# EAGLE design one_Mhz (EAGLE 7.7.0)
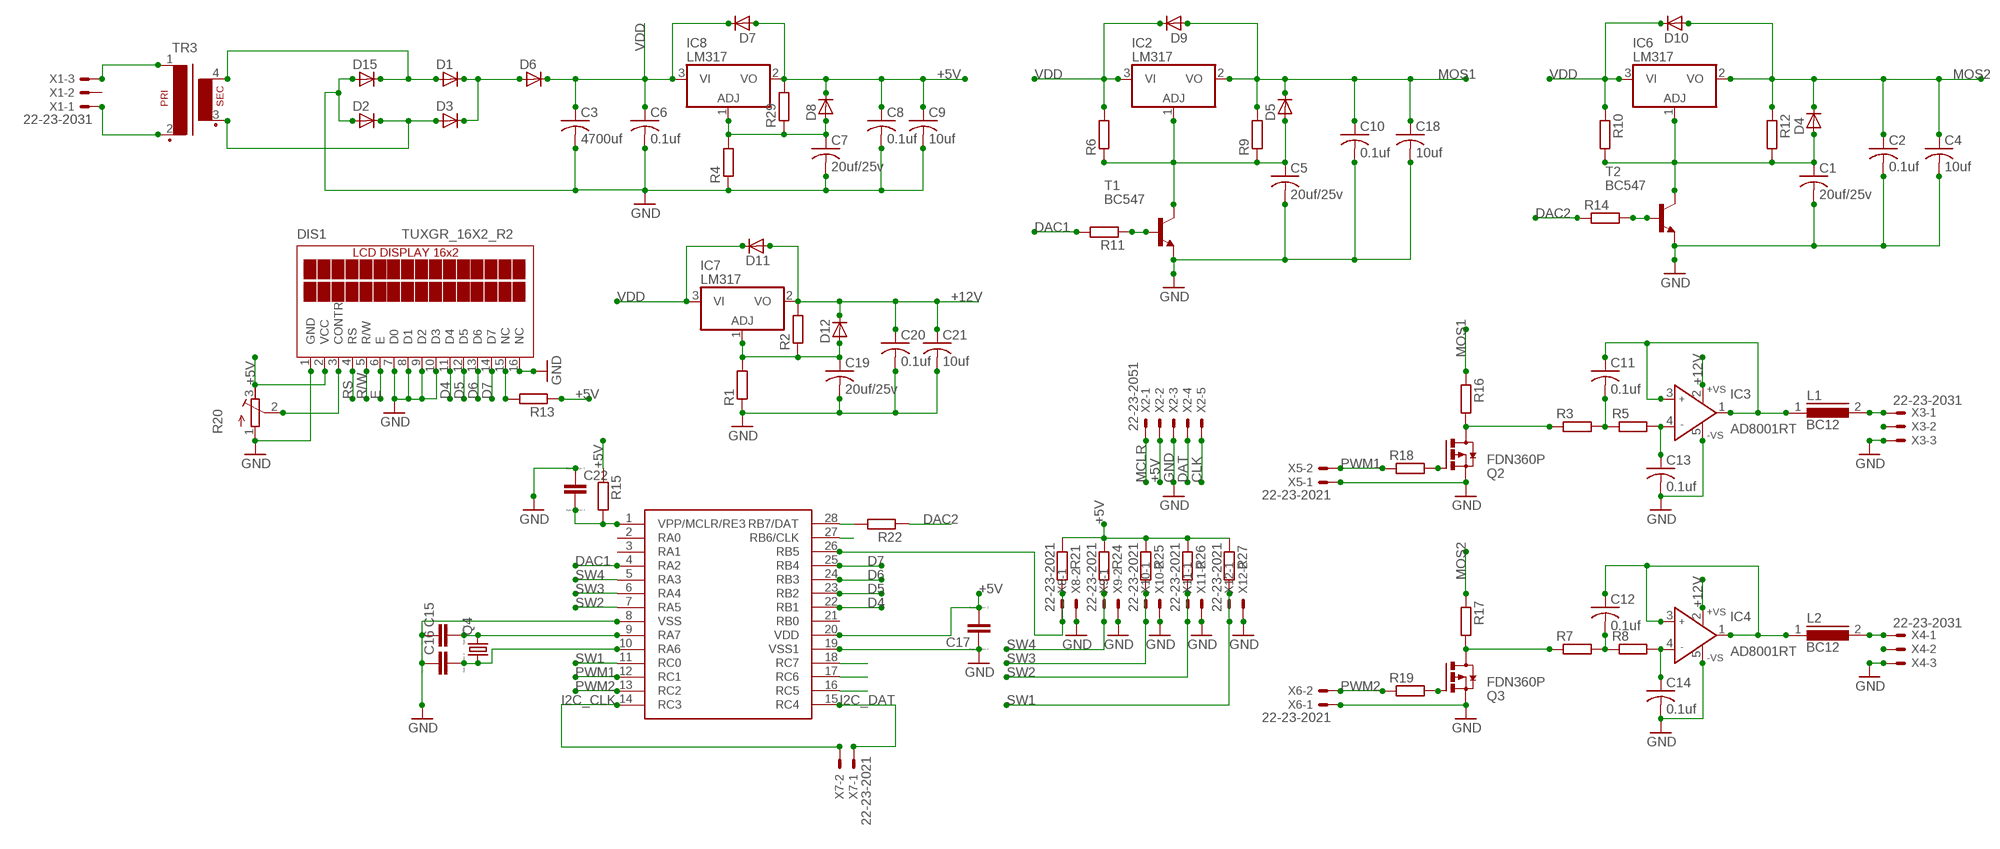
[diagram p0: schematic, sheet 1]

## Parts
C1  20uf/25v  C-US025-025X050  [C025-025X050]
C2  0.1uf  C-US025-025X050  [C025-025X050]
C3  4700uf  C-US025-025X050  [C025-025X050]
C4  10uf  C-US025-025X050  [C025-025X050]
C5  20uf/25v  C-US025-025X050  [C025-025X050]
C6  0.1uf  C-US025-025X050  [C025-025X050]
C7  20uf/25v  C-US025-025X050  [C025-025X050]
C8  0.1uf  C-US025-025X050  [C025-025X050]
C9  10uf  C-US025-025X050  [C025-025X050]
C10  0.1uf  C-US025-025X050  [C025-025X050]
C11  0.1uf  C-US025-025X050  [C025-025X050]
C12  0.1uf  C-US025-025X050  [C025-025X050]
C13  0.1uf  C-US025-025X050  [C025-025X050]
C14  0.1uf  C-US025-025X050  [C025-025X050]
C15  CC0603  [C0603]
C16  CC0603  [C0603]
C17  CC0603  [C0603]
C18  10uf  C-US025-025X050  [C025-025X050]
C19  20uf/25v  C-US025-025X050  [C025-025X050]
C20  0.1uf  C-US025-025X050  [C025-025X050]
C21  10uf  C-US025-025X050  [C025-025X050]
C22  CC0603  [C0603]
D1  D-SOD-87  [SOD87]
D2  D-SOD-87  [SOD87]
D3  D-SOD-87  [SOD87]
D4  D-SOD-87  [SOD87]
D5  D-SOD-87  [SOD87]
D6  D-SOD-87  [SOD87]
D7  D-SOD-87  [SOD87]
D8  D-SOD-87  [SOD87]
D9  D-SOD-87  [SOD87]
D10  D-SOD-87  [SOD87]
D11  D-SOD-87  [SOD87]
D12  D-SOD-87  [SOD87]
D15  D-SOD-87  [SOD87]
DIS1  TUXGR_16X2_R2  [TUXGR_16X2_R2]
IC2  LM317  78L05Z  [TO92]
IC3  AD8001RT  [SOT23-5]
IC4  AD8001RT  [SOT23-5]
IC6  LM317  78L05Z  [TO92]
IC7  LM317  7808T  [TO220H]
IC8  LM317  78L05Z  [TO92]
L1  BC12  [BC12]
L2  BC12  [BC12]
Q2  FDN360P  [SUPER-SOT3]
Q3  FDN360P  [SUPER-SOT3]
Q4  CRYSTALHC49U-V  [HC49U-V]
R1  R-EU_R0603  [R0603]
R2  R-EU_R0603  [R0603]
R3  R-EU_R0603  [R0603]
R4  R-EU_R0603  [R0603]
R5  R-EU_R0603  [R0603]
R6  R-EU_R0603  [R0603]
R7  R-EU_R0603  [R0603]
R8  R-EU_R0603  [R0603]
R9  R-EU_R0603  [R0603]
R10  R-EU_R0603  [R0603]
R11  R-EU_R0603  [R0603]
R12  R-EU_R0603  [R0603]
R13  R-EU_R0603  [R0603]
R14  R-EU_R0603  [R0603]
R15  R-EU_R0603  [R0603]
R16  R-EU_R0603  [R0603]
R17  R-EU_R0603  [R0603]
R18  R-EU_R0603  [R0603]
R19  R-EU_R0603  [R0603]
R20  R-TRIMM64X  [RTRIM64X]
R21  R-EU_R0603  [R0603]
R22  R-EU_R0603  [R0603]
R24  R-EU_R0603  [R0603]
R25  R-EU_R0603  [R0603]
R26  R-EU_R0603  [R0603]
R27  R-EU_R0603  [R0603]
R29  R-EU_R0603  [R0603]
T1  BC547  [TO92]
T2  BC547  [TO92]
TR3  VR13-1  [VR13-1]
U$1  PIC16F15345  [SO28W]
X1  22-23-2031  [22-23-2031]
X2  22-23-2051  [22-23-2051]
X3  22-23-2031  [22-23-2031]
X4  22-23-2031  [22-23-2031]
X5  22-23-2021  [22-23-2021]
X6  22-23-2021  [22-23-2021]
X7  22-23-2021  [22-23-2021]
X8  22-23-2021  [22-23-2021]
X9  22-23-2021  [22-23-2021]
X10  22-23-2021  [22-23-2021]
X11  22-23-2021  [22-23-2021]
X12  22-23-2021  [22-23-2021]

## Nets
+5V: C8.1 C9.1 C17.2 D7.2(A) D8.1(C) DIS1.2(VCC) IC8.2(VO) R13.1 R15.1 R20.3(E) R21.1 R24.1 R25.1 R26.1 R27.1 R29.2 U$1.20(VDD) X2.2
+12V: C20.1 C21.1 D11.2(A) D12.1(C) IC3.2(+VS) IC4.2(+VS) IC7.2(VO) R2.2
CLK: U$1.27(RB6/CLK) X2.5
D4: DIS1.11(D4) U$1.22(RB1)
D5: DIS1.12(D5) U$1.23(RB2)
D6: DIS1.13(D6) U$1.24(RB3)
D7: DIS1.14(D7) U$1.25(RB4)
DAC1: R11.2 U$1.4(RA2)
DAC2: R14.1 R22.1
DAT: R22.2 U$1.28(RB7/DAT) X2.4
E: DIS1.6(E) U$1.18(RC7)
GND: C1.2 C2.2 C3.2 C4.2 C5.2 C6.2 C7.2 C8.2 C9.2 C10.2 C13.2 C14.2 C15.1 C16.1 C17.1 C18.2 C19.2 C20.2 C21.2 C22.1 D2.2(A) D15.2(A) DIS1.1(GND) DIS1.7(D0) DIS1.8(D1) DIS1.9(D2) DIS1.10(D3) DIS1.16(NC) IC3.5(-VS) IC4.5(-VS) Q2.2(S) Q3.2(S) R1.1 R4.1 R20.1(A) T1.1(E) T2.1(E) U$1.8(VSS) U$1.19(VSS1) X2.3 X3.3 X4.3 X5.1 X6.1 X8.2 X9.2 X10.2 X11.2 X12.2
I2C_CLK: U$1.14(RC3) X7.2
I2C_DAT: U$1.15(RC4) X7.1
MCLR: C22.2 R15.2 U$1.1(VPP/MCLR/RE3) X2.1
MOS1: C10.1 C18.1 D5.1(C) D9.2(A) IC2.2(VO) R9.2 R16.1
MOS2: C2.1 C4.1 D4.1(C) D10.2(A) IC6.2(VO) R12.1 R17.1
N$1: L2.2 X4.1
N$3: D1.1(C) D3.1(C) D6.2(A)
N$4: D1.2(A) D15.1(C) TR3.4(S4)
N$5: D2.1(C) D3.2(A) TR3.3(S3)
N$6: Q3.3(D) R7.1 R17.2
N$7: C13.1 IC3.4(IN-) R5.2
N$8: DIS1.15(NC) R13.2
N$9: Q2.3(D) R3.1 R16.2
N$10: C7.1 D8.2(A) IC8.1(ADJ) R4.2 R29.1
N$11: R21.2 U$1.26(RB5) X8.1
N$12: X4.2
N$13: C14.1 IC4.4(IN-) R8.2
N$14: C12.2 R7.2 R8.1
N$15: C11.2 R3.2 R5.1
N$16: C11.1 IC3.1(OUT) IC3.3(IN+) L1.1
N$17: C12.1 IC4.1(OUT) IC4.3(IN+) L2.1
N$18: DIS1.3(CONTR) R20.2(S)
N$19: Q2.1(G) R18.2
N$20: Q3.1(G) R19.2
N$21: C5.1 D5.2(A) IC2.1(ADJ) R6.1 R9.1 T1.3(C)
N$22: C1.1 D4.2(A) IC6.1(ADJ) R10.2 R12.2 T2.3(C)
N$23: R11.1 T1.2(B)
N$24: R14.2 T2.2(B)
N$25: C19.1 D12.2(A) IC7.1(ADJ) R1.2 R2.1
N$27: L1.2 X3.1
N$28: X3.2
N$29: TR3.1 X1.3
N$30: TR3.2 X1.1
N$31: C16.2 Q4.1 U$1.10(RA6)
N$32: C15.2 Q4.2 U$1.9(RA7)
PWM1: R18.1 U$1.12(RC1) X5.2
PWM2: R19.1 U$1.13(RC2) X6.2
R/W: DIS1.5(R/W) U$1.17(RC6)
RS: DIS1.4(RS) U$1.16(RC5)
SW1: R27.2 U$1.11(RC0) X12.1
SW2: R26.2 U$1.7(RA5) X11.1
SW3: R25.2 U$1.6(RA4) X10.1
SW4: R24.2 U$1.5(RA3) X9.1
VDD: C3.1 C6.1 D6.1(C) D7.1(C) D9.1(C) D10.1(C) D11.1(C) IC2.3(VI) IC6.3(VI) IC7.3(VI) IC8.3(VI) R6.2 R10.1
Unconnected: U$1.2(RA0) U$1.3(RA1) U$1.21(RB0) X1.2

## Library data of the parts
C1-C14 C18-C21 = rcl:C-US: CAPACITOR, American symbol
C15-C17 C22 = eagle-ltspice:C: CAPACITOR, European symbol; SPICEMODEL: NONE; SPICEPREFIX: C
D1-D12 D15 = semicon-smd-ipc:D-: DIODE unfilled
DIS1 = display-lcd:TUXGR_16X2_R2: Tuxgraphics LCD display 16x2 characters reflective, without background light Source: tuxgr_12x2_r2.pdf; OC_FARNELL: unknown; OC_NEWARK: unknown
IC2 IC6-IC8 = lm317:78*: Positive VOLTAGE REGULATOR Source: http://cache.national.com/ds/LM/LM78L05.pdf http://www.fairchildsemi.com/ds/LM/LM7805.pdf
IC3 IC4 = analog-devices:AD8001: 800 MHz, 50 mW Current Feedback Amplifier Source: http://www.analog.com/static/imported-files/data_sheets/AD8001.pdf; MF: ALTERA CORPORATION; MPN: AD8001ARTZ-REEL7; OC_FARNELL: 1651271; OC_NEWARK: 59K6136
L1 L2 = inductors:BC12: INDUCTOR
Q2 Q3 = transistor-power:FDN360P: Single P-Channel, PowerTrench (R) MOSFET Source: http://www.fairchildsemi.com/ds/FD/FDN360P.pdf
Q4 = crystal:CRYSTAL: CRYSTAL; OC_FARNELL: 1666969; OC_NEWARK: unknown
R1-R19 R21 R22 R24-R27 R29 = rcl:R-EU_: RESISTOR, European symbol
R20 = rcl:R-TRIMM: Trimm resistor
T1 T2 = transistor-neu-to92:BC547: NPN TRANSISTOR
TR3 = trafo:VR13-1: TRANSFORMER 1 primary winding, 1 secondary winding, mounting holes BLOCK
U$1 = microchip:PIC16F15345
X1 X3 X4 = con-molex:22-23-2031: .100" (2.54mm) Center Header - 3 Pin; MF: MOLEX; MPN: 22-23-2031; OC_FARNELL: 1462950; OC_NEWARK: 30C0862
X2 = con-molex:22-23-2051: .100" (2.54mm) Center Header - 5 Pin; MF: MOLEX; MPN: 22-23-2051; OC_FARNELL: 1462952; OC_NEWARK: 38C9178
X5-X12 = con-molex:22-23-2021: .100" (2.54mm) Center Header - 2 Pin; MF: MOLEX; MPN: 22-23-2021; OC_FARNELL: 1462926; OC_NEWARK: 25C3832

## Board
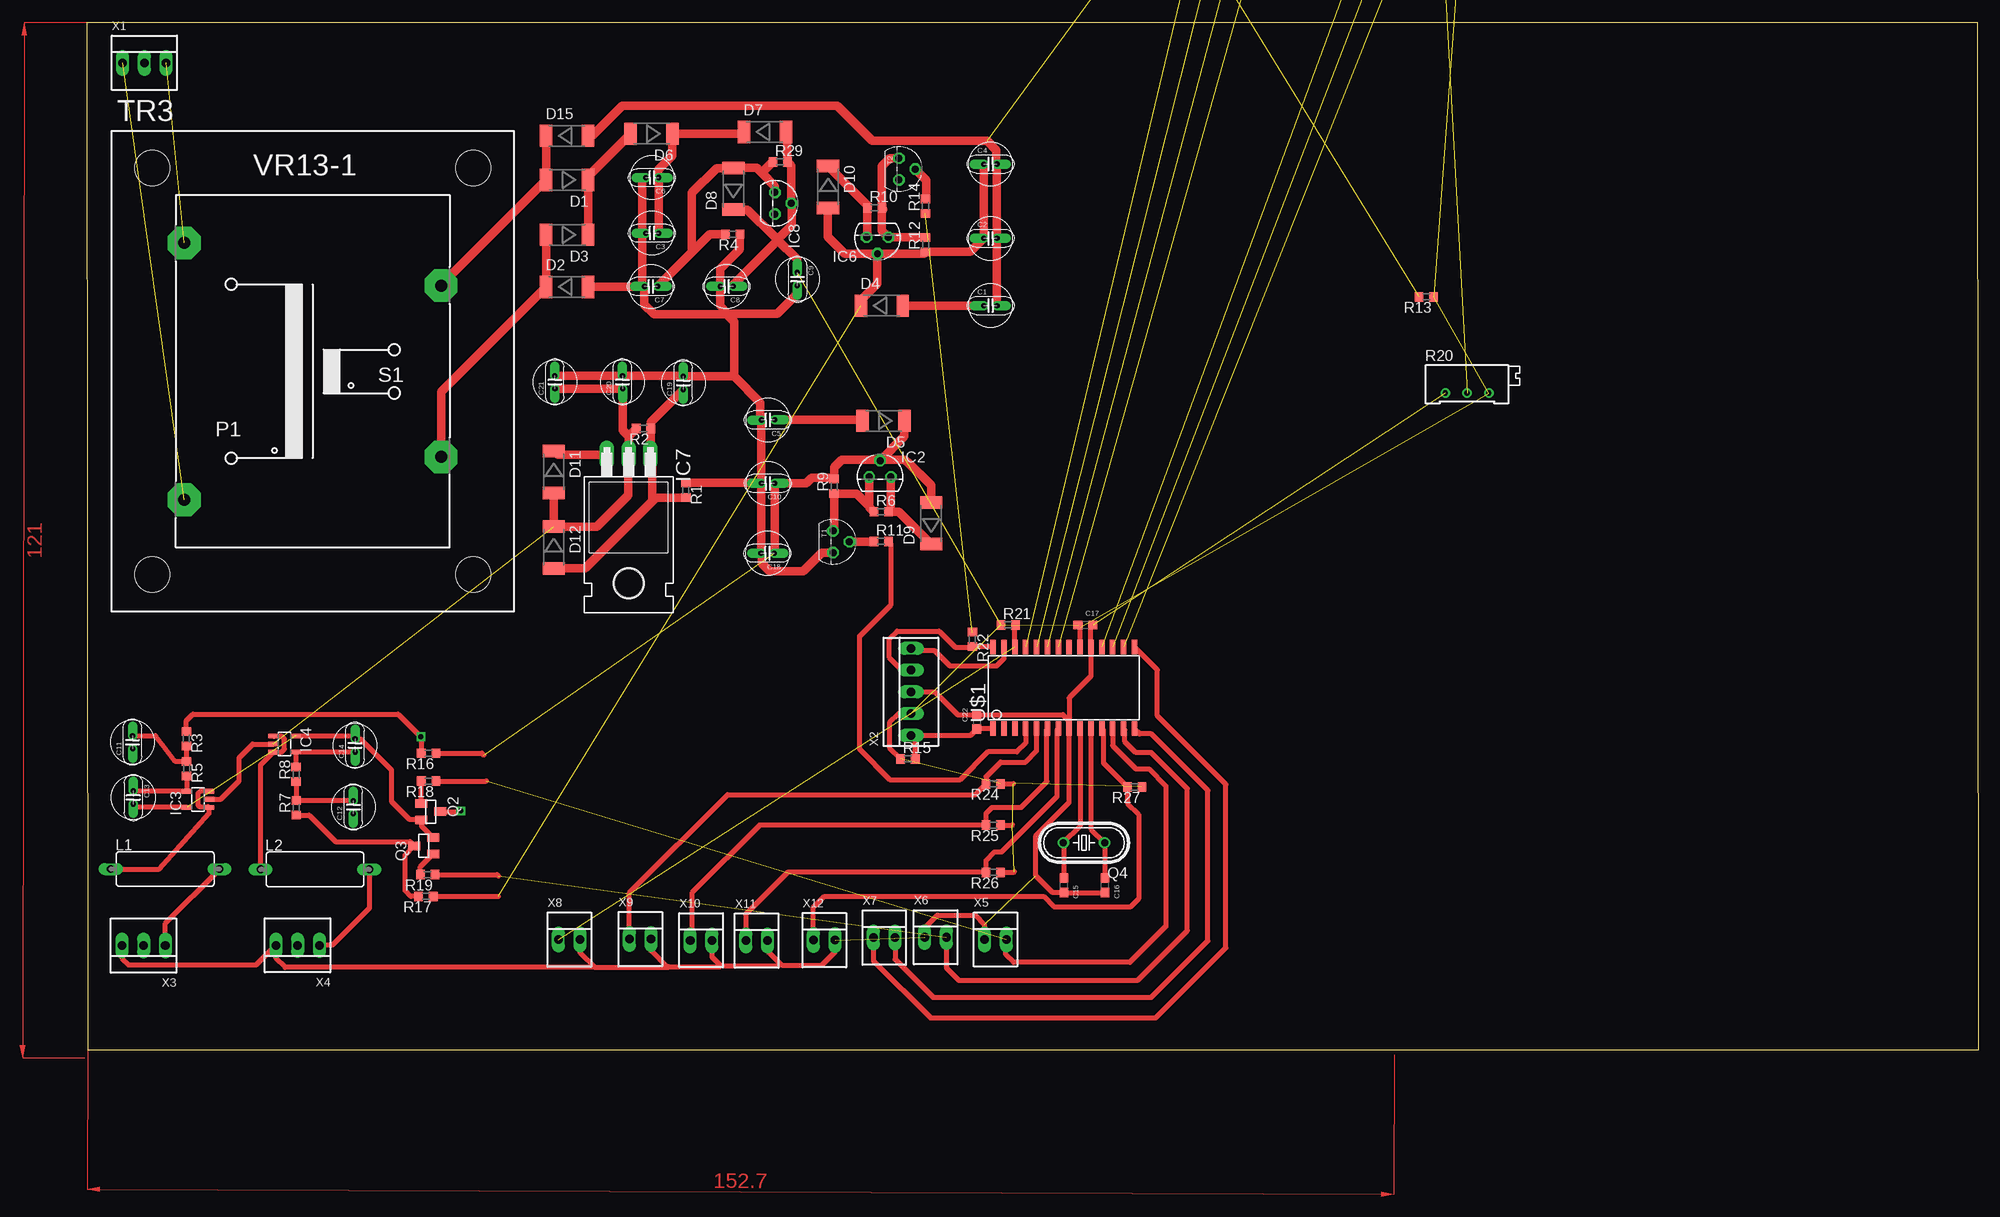
[diagram p1: board, top side]
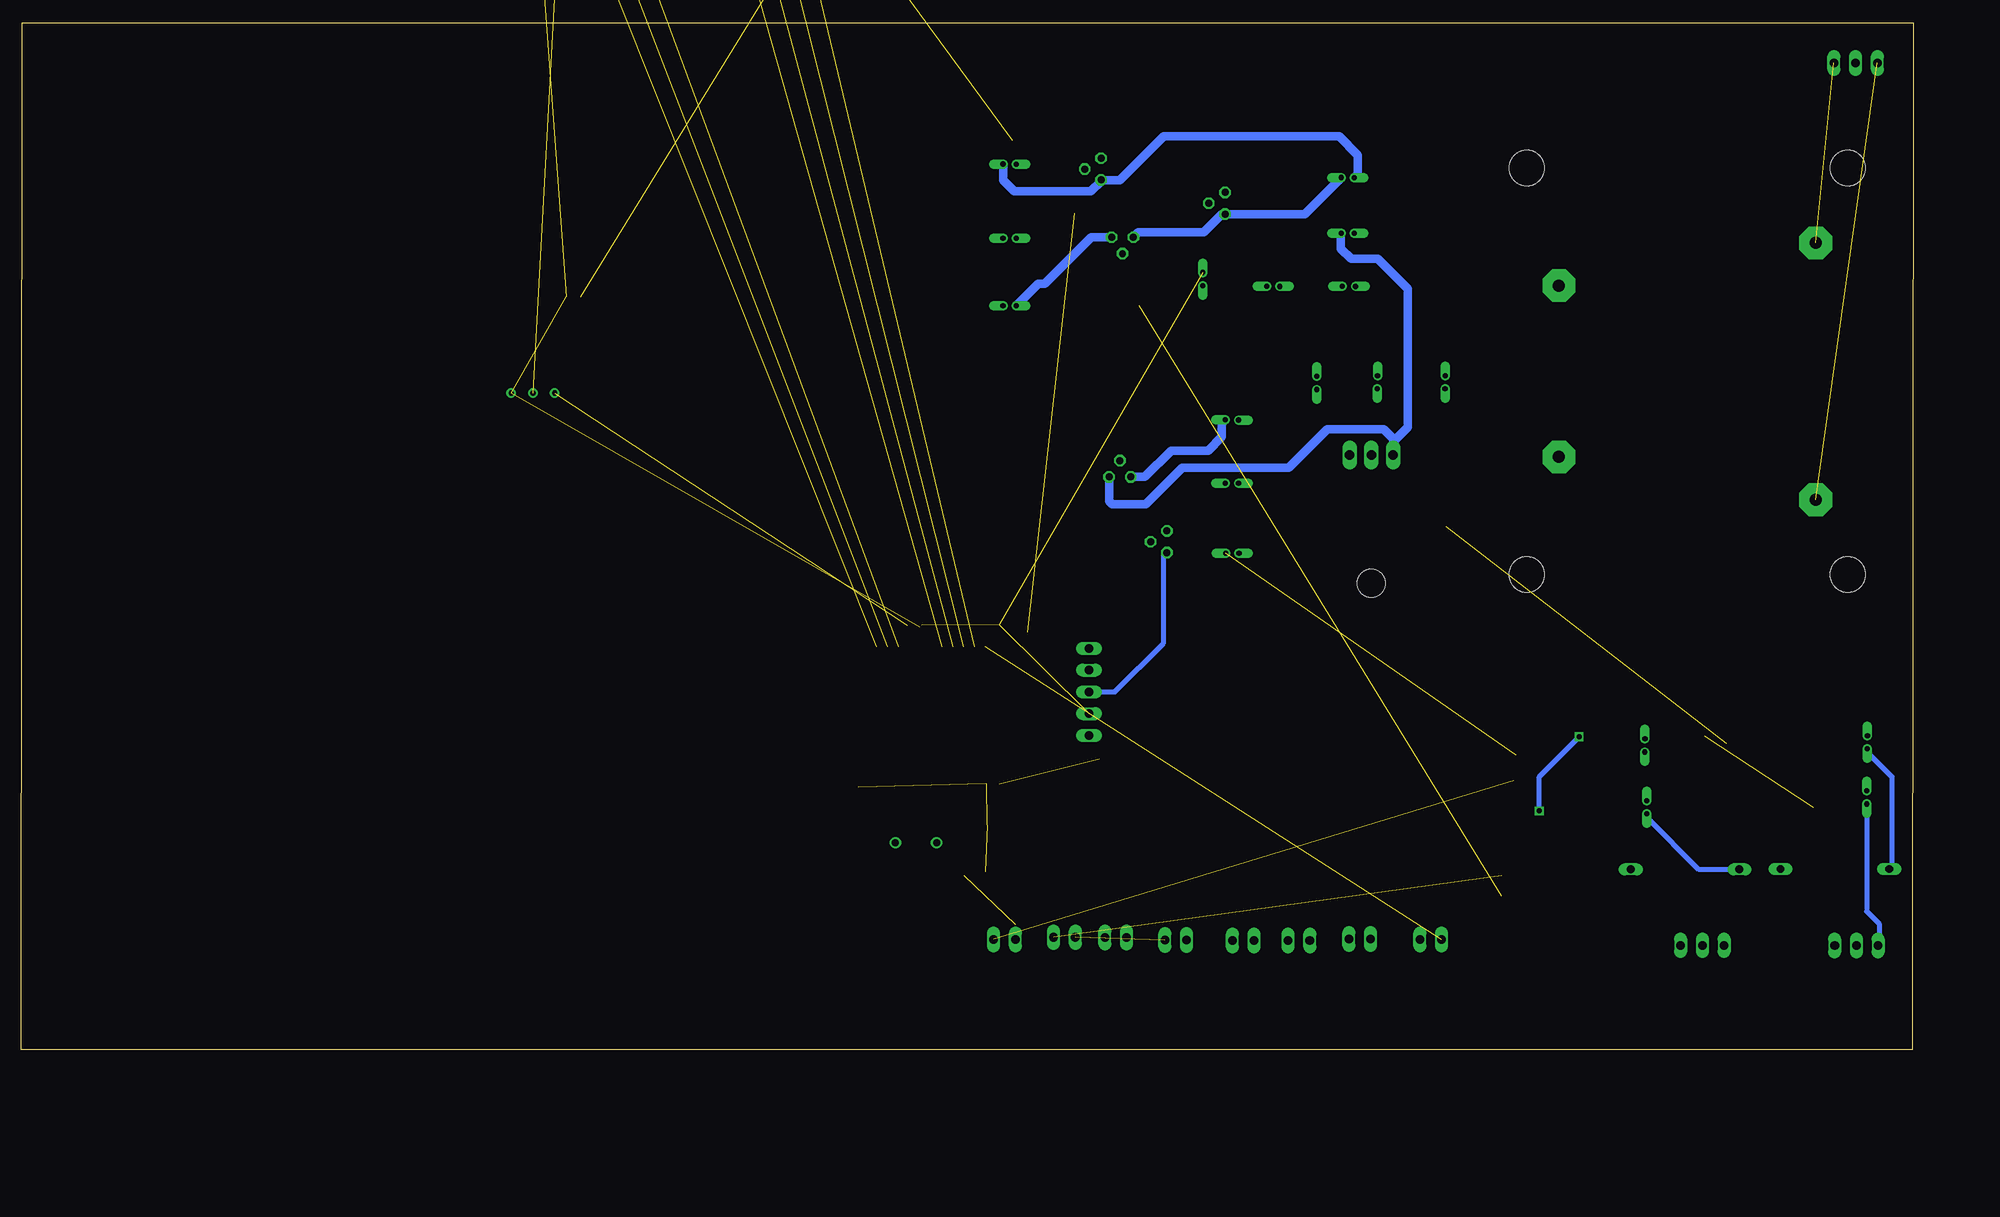
[diagram p2: board, bottom side, seen from below]

Size 221.06 x 120 mm. Coordinates in mm from the lower left corner, seen from the top.
Outline: 0.1,0 221.06,0 220.96,120 0,120 0.1,0
Copper layers (1*16): Top 0.035mm / dielectric 1.5mm / Bottom 0.035mm
Design rules "default": minimum track width 10mil, minimum drill 24mil, track to track 8mil, track to pad 8mil, pad to pad 8mil, via to via 8mil, smd to smd 8mil, copper to edge 40mil, drill to drill 8mil, minimum pad ring 10mil, minimum via ring 8mil, stop-mask expansion 4mil, vias tented up to drill 0mil, thermal gap 10mil

### Footprints (pad centres in the part's own frame; a part is rotated, then mirrored left to right if it is on the bottom)
C025-025X050 = drill 0.6 pad 0.889 offset: 1 -0.776,-0.006; 2 0.759,0.007
C0603 = smd 1.1 x 1: 1 -0.85,0; 2 0.85,0
SOD87 = smd 1.45 x 2.6: 1 -2.445,0; 2 2.445,0
TUXGR_16X2_R2 = drill 1 pad 1.676: 1 -32,15.5; 2 -29.46,15.5; 3 -26.92,15.5; 4 -24.38,15.5; 5 -21.84,15.5; 6 -19.3,15.5; 7 -16.76,15.5; 8 -14.22,15.5; 9 -11.68,15.5; 10 -9.14,15.5; 11 -6.6,15.5; 12 -4.06,15.5; 13 -1.52,15.5; 14 1.02,15.5; 15 3.56,15.5; 16 6.1,15.5 | hole 2.5: -37.5,-15.5; 37.5,-15.5; -37.5,15.5; 37.5,15.5
TO92 = drill 0.813 octagon: 1 -1.27,0; 2 0,1.905; 3 1.27,0
SOT23-5 = smd 0.55 x 1.2: 1 -0.95,-1.3; 2 0,-1.3; 3 0.95,-1.3; 4 0.95,1.3; 5 -0.95,1.3
TO220H = drill 1.118 long: 1 -2.54,-10.16; 2 0,-10.16; 3 2.54,-10.16 | hole 3.302: 0,4.826
BC12 = drill 0.914 long: 1 -6.35,0; 2 6.35,0
SUPER-SOT3 = smd 1 x 1.4: 1 -0.95,-1.1; 2 0.95,-1.1; 3 0,1.1
HC49U-V = drill 0.813: 1 -2.413,0; 2 2.413,0
R0603 = smd 1 x 1.1: 1 -0.85,0; 2 0.85,0
RTRIM64X = drill 0.61: 1 1.27,-2.54; 2 1.27,0; 3 1.27,2.54
TO92' = drill 0.813 octagon: 1 1.27,0; 2 0,1.905; 3 -1.27,0
VR13-1 = drill 1.397 pad 3.81 octagon: 1 -15.011,15.011; 2 -15.011,-15.011; 3 15.011,-10.008; 4 15.011,10.008 | hole 4.115: -18.745,-23.749; 18.745,-23.749; 18.745,23.749; -18.745,23.749
SO28W = smd 0.65 x 1.7: 1 -7.62,-4.78; 2 -6.35,-4.78; 3 -5.08,-4.78; 4 -3.81,-4.78; 5 -2.54,-4.78; 6 -1.27,-4.78; 7 0,-4.78; 8 1.27,-4.78; 9 2.54,-4.78; 10 3.81,-4.78; 11 5.08,-4.78; 12 6.35,-4.78; 13 7.62,-4.78; 14 8.89,-4.78; 15 8.89,4.78; 16 7.62,4.78; 17 6.35,4.78; 18 5.08,4.78; 19 3.81,4.78; 20 2.54,4.78; 21 1.27,4.78; 22 0,4.78; 23 -1.27,4.78; 24 -2.54,4.78; 25 -3.81,4.78; 26 -5.08,4.78; 27 -6.35,4.78; 28 -7.62,4.78
22-23-2031 = drill 1 long: 1 -2.54,0; 2 0,0; 3 2.54,0
22-23-2051 = drill 1 long: 1 -5.08,0; 2 -2.54,0; 3 0,0; 4 2.54,0; 5 5.08,0
22-23-2021 = drill 1 long: 1 -1.27,0; 2 1.27,0

### Placement (x,y rotation side)
C1  105.6,86.93 0 top
C2  105.6,94.8 0 top
C3  66.06,95.4 180 top
C4  105.6,103.47 0 top
C5  79.6,73.57 180 top
C6  66.06,101.89 180 top
C7  65.93,89.18 180 top
C8  74.78,89.18 180 top
C9  83.03,90.02 270 top
C10  79.6,66.17 180 top
C11  5.36,35.92 90 top
C12  31.16,28.33 90 top
C13  5.44,29.46 270 top
C14  31.36,35.55 90 top
C15  114.2,19.2 90 top
C16  119,19.2 90 top
C17  116.7,49.6 180 top
C18  79.55,58 180 top
C19  69.71,77.9 90 top
C20  62.61,78 90 top
C21  54.71,78 90 top
C22  104,38.3 270 top
D1  56.13,101.62 180 top
D2  56.13,89.12 0 top
D3  56.13,95.2 180 top
D4  92.91,86.93 0 top
D5  93.09,73.47 180 top
D6  65.99,107.02 180 top
D7  79.25,107.22 0 top
D8  75.57,100.59 90 top
D9  98.67,61.5 90 top
D10  86.63,100.78 270 top
D11  54.57,67.48 270 top
D12  54.57,58.67 270 top
D15  56.13,106.77 0 top
DIS1  131.28,149.04 180 top  (outside the outline)
IC2  92.7,66.92 0 top
IC3  12.99,29.25 90 top
IC4  23.11,35.71 270 top
IC6  92.4,94.92 180 top
IC7  63.32,59.32 180 top
IC8  80.42,98.89 270 top
L1  9.17,21.1 0 top
L2  26.67,21.06 0 top
Q2  40.21,27.8 270 top
Q3  39.39,23.81 90 top
Q4  116.53,24.17 180 top
R1  70.01,65.36 270 top
R2  65.06,72.57 180 top
R3  11.65,36.34 270 top
R4  75.49,95.27 180 top
R5  11.67,32.84 270 top
R6  92.82,62.85 0 top
R7  24.49,28.26 90 top
R8  24.47,32.16 90 top
R9  87.33,65.82 90 top
R10  92.06,98.35 0 top
R11  92.82,59.39 0 top
R12  98.03,94.06 90 top
R13  156.54,87.95 180 top
R14  98.01,98.56 90 top
R15  95.96,33.97 0 top
R16  39.94,34.63 180 top
R17  39.64,17.91 180 top
R18  39.94,31.37 180 top
R19  39.84,20.45 180 top
R20  161.29,77.99 270 top
R21  107.66,49.63 0 top
R22  103.49,47.94 270 top
R24  105.94,31.05 180 top
R25  105.94,26.23 180 top
R26  105.94,20.71 180 top
R27  122.44,30.69 180 top
R29  81.02,103.73 0 top
T1  BC547  [TO92']  87.21,59.34 270 top
T2  BC547  [TO92']  94.91,102.89 270 top
TR3  26.41,79.26 0 top
U$1  113.53,42.28 0 top
X1  6.74,115.3 0 top
X2  96.3,41.8 90 top
X3  6.64,12.15 180 top
X4  24.64,12.19 180 top
X5  106.19,12.87 0 top
X6  99.19,13.13 0 top
X7  93.19,13.09 0 top
X8  56.39,12.85 0 top
X9  64.69,12.91 0 top
X10  71.79,12.77 0 top
X11  78.29,12.73 0 top
X12  86.19,12.79 0 top

### Tracks (layer width: path | path; a pad name or v marks a point on that pad's centre or on a via)
+5V  (10 unrouted)
  Top 0.61: U$1.20 116.07,49.38 C17.2 | X2.2 94.86,39.26 93.8,38.2 93.8,35.28 R15.1 | R24.1 108.25,31.05 108.3,31.1 | R25.1 108.13,26.23 108.2,26.3 | R26.1 108.31,20.71 108.4,20.8
  Top 1.016: D7.2 81.87,107.05 R29.2 82.33,103.27 IC8.2 82.4,98.81 82.4,96.3 80.94,94.84 80.5,94.84 | 75.47,89.27 C8.1 75.56,89.36 80.77,94.57 | C9.1 83.02,92.32 80.77,94.57 | 80.77,94.57 80.5,94.84 | D8.1 77.2,98.14 80.5,94.84
+12V  (1 unrouted)
  Top 0.61: 21.75,35.65 IC4.2 19.4,35.7 17.8,34.1 17.8,31.4 15.65,29.25 IC3.2
  Top 1.016: C21.1 C20.1 62.62,72.38 63.32,71.68 | 63.02,69.78 IC7.2 | D11.2 D12.1 59.62,61.11 63.3,64.8 63.3,69.46 IC7.2 | IC7.2 63.32,71.68 | 63.32,71.68 R2.2
CLK
  Top 0.61: U$1.27 107.18,45.68 106.3,44.8 100.9,44.8 99.1,46.6 96.58,46.6 X2.5
D4  (1 unrouted)
D5  (1 unrouted)
D6  (1 unrouted)
D7  (1 unrouted)
DAC1
  Top 0.61: U$1.4 109.72,35.82 108.7,34.8 105.3,34.8 102,31.5 93.9,31.5 90.3,35.1 90.3,48.3 94,52 94,59.06 R11.2
DAC2  (1 unrouted)
DAT
  Top 0.61: U$1.28 104.04,47.06 R22.2 103.4,47 101.5,47 99.6,48.9 94.7,48.9 93.8,48 93.8,45.8 95.26,44.34 X2.4
E  (1 unrouted)
GND  (11 unrouted)
  Top 0.61: X2.3 99.1,41.8 101.8,39.1 103.95,39.1 C22.1 114.05,39.15 114.75,38.45 | 114.75,38.45 114.8,38.4 U$1.8 114.8,28.9 110.9,25 110.9,20.3 112.85,18.35 C15.1 C16.1 | C17.1 117.34,49.39 U$1.19 117.34,43.64 114.8,41.1 114.8,38.5 114.75,38.45 | IC3.5 5.85,28.3 C13.2 | X3.3 4.1,10.7 4.9,9.9 19.81,9.9 X4.3 22.1,10.7 23.2,9.6 59.4,9.6 | IC4.5 31,36.66 C14.2 31.99,36.31 35.6,32.7 35.6,29 37.7,26.9 39.06,26.9 Q2.2 39.11,26.14 Q3.2 | X6.1 97.92,14.22 99.4,15.7 103.8,15.7 104.9,14.6 104.9,12.89 X5.1 | X12.2 87.46,11.46 85.8,9.8 81.3,9.8 81.05,10.05 | 81.05,10.05 79.6,11.5 79.6,12.69 X11.2 | X10.2 73.06,10.84 74.1,9.8 | 74.1,9.8 80.8,9.8 81.05,10.05 | X9.2 65.96,11.54 67.8,9.7 | 67.8,9.7 68,9.7 | 68,9.7 74,9.7 74.1,9.8 | X8.2 57.66,11.34 59.4,9.6 | 67.7,9.6 67.8,9.7 | 59.4,9.6 67.9,9.6 68,9.7
  Top 1.016: 64.93,95.02 C3.2 | 64.93,95.02 64.93,101.53 65.3,101.9 | 64.93,95.02 64.93,89.42 C7.2 | C9.2 83.04,88.34 80.7,86 74.9,86 | 74.9,86 74,86.9 74,89.15 C8.2 74.02,91.22 76.3,93.5 76.3,95.23 R4.1 | C7.2 65.17,87.03 66.3,85.9 74.8,85.9 | 74.8,85.9 74.9,86 | C21.2 C20.2 69.6,78.76 C19.2 75.64,78.66 | 75.64,78.66 78.7,75.6 78.7,73.7 C5.2 C10.2 | C10.2 78.84,58.04 C18.2 78.9,57.88 78.9,56.8 79.8,55.9 83.7,55.9 85.87,58.07 T1.1 | R1.1 78.8,66.21 C10.2 | 75.64,78.66 75.64,85.06 74.8,85.9 | C1.2 C2.2 C4.2 106.3,103.53 106.3,105.1 105.2,106.2 91.8,106.2 87.7,110.3 62.6,110.3 59.07,106.77 D15.2 | D2.2 65.12,89.12 C7.2
  Bottom 0.61: X2.3 93.3,41.8 87.6,47.5 87.6,57.68 T1.1 | C13.2 5.45,16.15 4,14.7 4,12.25 X3.3
  Bottom 1.016: C6.2 64.9,102.28 64.9,104.5 67.1,106.7 87.6,106.7 92.7,101.6 94.89,101.6 T2.1 94.91,101.49 96.1,100.3 105.06,100.3 106.36,101.6 C4.2
I2C_CLK
  Top 0.61: X7.2 94.46,10.54 98.9,6.1 124.4,6.1 131,12.7 131,30.3 124.4,36.9 123.02,36.9 U$1.14
I2C_DAT
  Top 0.61: X7.1 91.92,10.38 98.6,3.7 124.9,3.7 133.1,11.9 133.1,31 125.1,39 125.1,44.38 U$1.15
MCLR
  Top 0.61: U$1.1 104.05,37.5 C22.2 103.27,36.72 X2.1 96.81,36.21 R15.2
MOS1  (1 unrouted)
  Top 0.61: R16.1 46.17,34.63 46.4,34.4
  Top 1.016: C18.1 80.38,58.06 C10.1 84.08,66.18 84.7,66.8 87.2,66.8 R9.2 87.33,68.03 88.2,68.9 92.62,68.9 IC2.2 | D5.1 95.53,71.66 IC2.2 | D9.2 98.67,65.93 95.9,68.7 95.8,68.7 95.6,68.9 92.78,68.9 IC2.2
MOS2  (1 unrouted)
  Top 0.61: R17.1 48.09,17.91 48.1,17.9
  Top 1.016: C4.1 C2.1 103.24,93.21 R12.1 97.83,93.02 IC6.2 | IC6.2 92.4,89.5 90.7,87.8 90.7,87.16 D4.1 | IC6.2 88.58,93.02 86.6,95 86.6,98.3 D10.2
N$1
  Top 0.61: L2.2 33.02,16.52 28.7,12.2 X4.1
N$3
  Top 1.016: 63.45,106.92 D6.2 58.58,102.05 D1.1 D3.1
N$4
  Top 1.016: TR3.4 42.38,89.27 42.38,90.32 D1.2 D15.1
N$5
  Top 1.016: D3.2 D2.1 41.42,76.86 TR3.3
N$6
  Top 0.61: R7.1 25.99,27.41 29.1,24.3 37.8,24.3 Q3.3 37.2,22.72 37.2,18.6 37.89,17.91 R17.2
N$7
  Top 0.61: C13.1 5.47,30.2 IC3.4 11.67,30.22 R5.2
N$8  (1 unrouted)
N$9  (via drill 0.6)
  Top 0.61: R3.1 11.65,38.45 12.4,39.2 36.4,39.2 v39.05,36.55 39.1,36.5 R16.2 | Q2.3 43.6,27.8 v43.7,27.9
  Bottom 0.61: v43.7,27.9 43.7,31.9 v39.05,36.55
N$10
  Top 1.016: 78.87,102.43 R29.1 | IC8.1 80.42,100.88 78.87,102.43 | 70.7,93.18 70.7,100.1 73.6,103 75.53,103 D8.2 78.27,103.03 78.87,102.43 | 70.7,93.18 C7.1 | R4.2 72.79,95.27 70.7,93.18
N$11  (1 unrouted)
  Top 0.61: U$1.26 108.45,49.57 R21.2
N$13
  Top 0.61: C14.1 24.42,34.77 IC4.4 24.47,34.7 R8.2
N$14
  Top 0.61: R8.1 24.47,29.13 R7.2 31.13,29.11 C12.2
N$15
  Top 0.61: C11.2 8.02,36.68 10.3,33.7 R5.1 11.67,35.47 R3.2
N$16
  Top 0.61: IC3.3 13.3,30.2 13,29.9 13,28.6 13.2,28.4 14.19,28.4 IC3.1 14.3,27.6 8.5,21.1 L1.1
  Bottom 0.61: C11.1 5.37,34.77 2.5,31.9 2.5,21.42 L1.1
N$17
  Top 0.61: IC4.1 21.87,36.6 22.8,36.6 23.1,36.3 23.1,35.1 22.76,34.76 IC4.3 20.32,33.27 L2.1
  Bottom 0.61: C12.1 31.17,27.17 25.1,21.1 20.36,21.1 L2.1
N$18  (1 unrouted)
N$19
  Top 0.61: Q2.1 39.11,31.35 R18.2
N$20
  Top 0.61: R19.2 38.99,21.36 Q3.1
N$21
  Top 1.016: C5.1 90.54,73.58 D5.2 | IC2.1 91.43,63.5 | 91.43,63.5 91.43,63.39 R6.1 | 91.43,63.5 89.96,64.97 R9.1 87.33,60.73 T1.3
  Bottom 1.016: IC2.1 89.78,66.92 86.7,70 82.4,70 80.8,71.6 80.8,73.15 C5.1
N$22
  Top 1.016: C1.1 95.36,86.92 D4.2 | R12.2 IC6.1 92.91,95.68 R10.2 | 93.06,98.2 R10.2 | T2.3 93.86,104.16 92.9,103.2 R10.2
  Bottom 1.016: IC6.1 96.08,94.92 101.5,89.5 102.25,89.5 C1.1
N$23
  Top 1.016: T1.2 91.92,59.34 R11.1
N$24
  Top 1.016: T2.2 98.1,101.6 98.1,99.5 R14.2
N$25
  Top 1.016: D12.2 58.23,56.22 66.1,64.1 | 66.1,64.1 66.1,69.24 IC7.1 65.91,69.53 R2.1 65.91,73.32 C19.1 | R1.2 66.51,64.51 66.1,64.1
N$27
  Top 0.61: X3.1 9.18,14.76 L1.2
N$29  (1 unrouted)
N$30  (1 unrouted)
N$31
  Top 0.61: U$1.10 117.34,25.77 Q4.1 119,24.11 C16.2
N$32
  Top 0.61: U$1.9 116.07,26.12 Q4.2 114.2,24.09 C15.2
PWM1  (1 unrouted)
  Top 0.61: R18.1 46.67,31.37 46.7,31.4 | U$1.12 119.88,35.52 122.6,32.8 124.1,32.8 126.1,30.8 126.1,14.4 121.9,10.2 108.3,10.2 107.4,11.1 107.4,12.81 X5.2
PWM2  (1 unrouted)
  Top 0.61: R19.1 47.95,20.45 48.1,20.3 | X6.2 100.46,9.54 101.9,8.1 122.8,8.1 128.6,13.9 128.6,30.5 124.4,34.7 122.6,34.7 121.3,36 121.3,37.35 U$1.13
R/W  (1 unrouted)
RS  (1 unrouted)
SW1
  Top 0.61: U$1.11 118.79,37.32 118.79,33.49 R27.2 121.59,28.81 122.9,27.5 122.9,17.6 122,16.7 113,16.7 111.8,17.9 86.2,17.9 84.92,16.62 X12.1
SW2
  Top 0.61: U$1.7 113.4,37.37 113.4,29.6 106.9,23.1 106.1,23.1 105.09,22.09 R26.2 81.91,20.71 77,15.8 77,12.75 X11.1
SW3
  Top 0.61: U$1.6 112.2,37.44 112.2,31.3 109.2,28.3 105.8,28.3 105.09,27.59 R25.2 78.63,26.23 70.7,18.3 70.7,12.95 X10.1
SW4
  Top 0.61: U$1.5 111,34.9 109.7,33.6 106.8,33.6 105.1,31.9 R24.2 103.84,29.8 74.9,29.8 63.42,18.32 X9.1
VDD
  Top 1.016: C3.1 C6.1 66.8,101.93 66.8,102.8 68.44,104.44 D6.1 76.61,107.02 D7.1 | IC7.3 55.02,69.48 D11.1 | IC2.3 93.97,63.15 R6.2 94.88,62.85 D9.1 | IC6.3 91.21,95 R10.1 91.21,98.64 D10.1
  Bottom 1.016: C6.1 71.11,97.62 IC8.3 80.78,97.62 82.9,95.5 90.55,95.5 IC6.3 | IC2.3 93.97,64.07 93.6,63.7 89.7,63.7 85.4,68 73,68 68.5,72.5 61.9,72.5 60.6,71.2 | 60.7,69.4 IC7.3 60.78,71.02 60.6,71.2 | 60.6,71.2 59.1,72.7 59.1,88.9 62.6,92.4 65.7,92.4 66.9,93.6 66.9,95.34 C3.1
(copper drawn outside any net)
  shapes: Top area x2